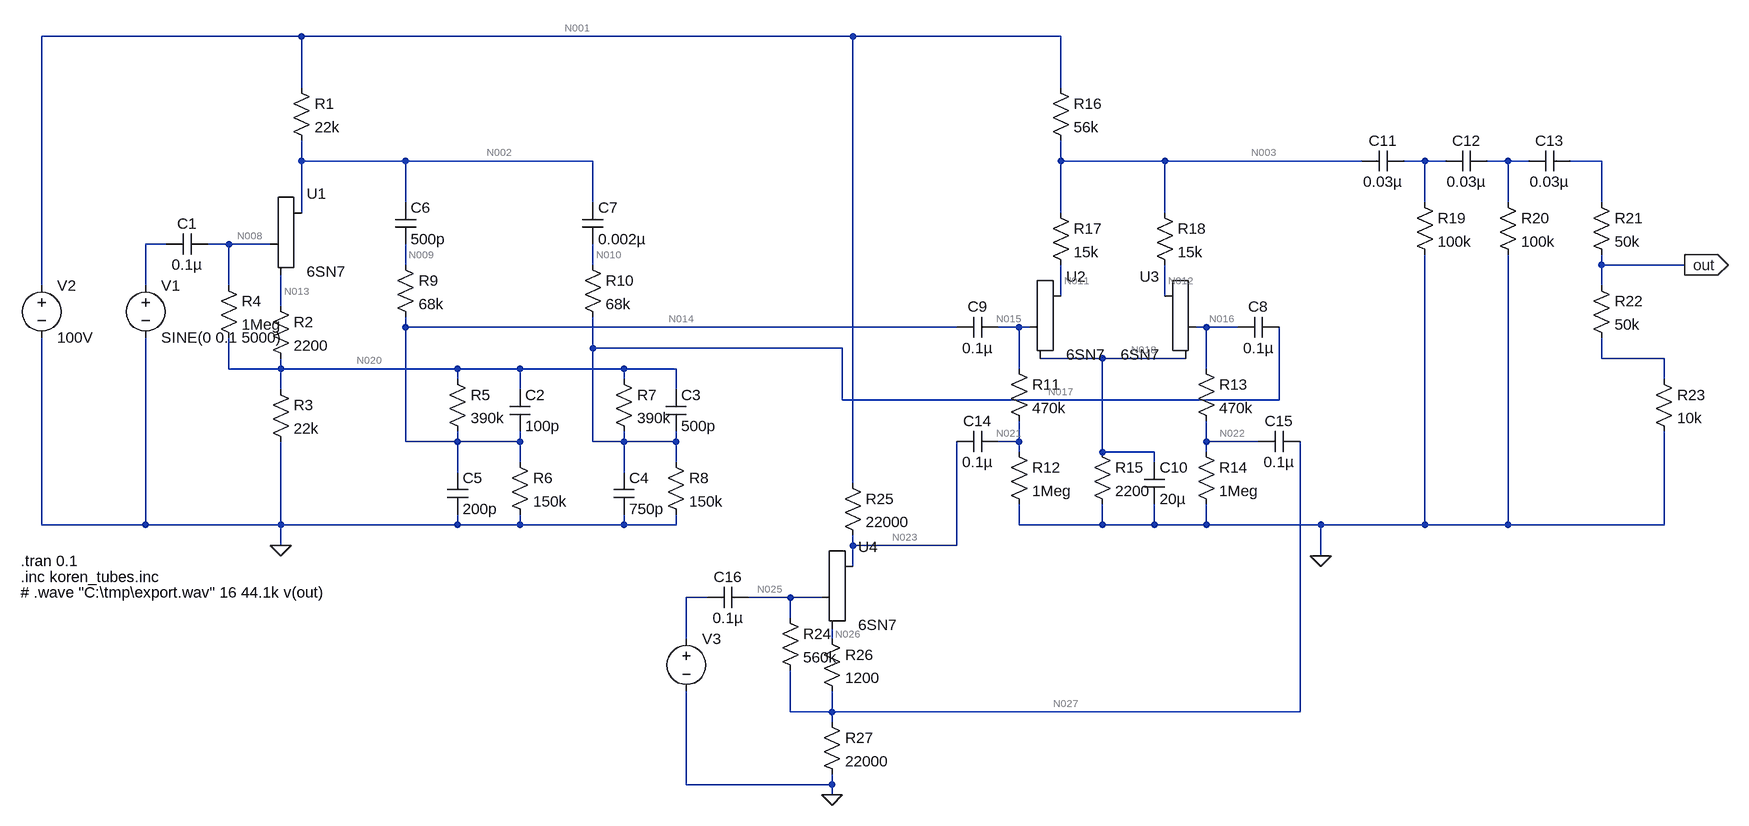
[diagram p0: schematic wurlitzer vibrato.asc]
wurlitzer vibrato.asc, the LTspice schematic file:
Version 4
SHEET 1 2576 1012
WIRE 192 -176 -208 -176
WIRE 1040 -176 192 -176
WIRE 1360 -176 1040 -176
WIRE 192 -96 192 -176
WIRE 1360 -96 1360 -176
WIRE 192 16 192 -16
WIRE 352 16 192 16
WIRE 640 16 352 16
WIRE 1360 16 1360 -16
WIRE 1520 16 1360 16
WIRE 1824 16 1520 16
WIRE 1920 16 1888 16
WIRE 1952 16 1920 16
WIRE 2048 16 2016 16
WIRE 2080 16 2048 16
WIRE 2192 16 2144 16
WIRE 352 80 352 16
WIRE 640 80 640 16
WIRE 1920 80 1920 16
WIRE 2048 80 2048 16
WIRE 2192 80 2192 16
WIRE 192 96 192 16
WIRE 1360 96 1360 16
WIRE 1520 96 1520 16
WIRE -16 144 -48 144
WIRE 80 144 48 144
WIRE 144 144 80 144
WIRE 352 176 352 144
WIRE 640 176 640 144
WIRE 2192 176 2192 160
WIRE 2320 176 2192 176
WIRE -208 208 -208 -176
WIRE -48 208 -48 144
WIRE 80 208 80 144
WIRE 2192 208 2192 176
WIRE 1360 224 1360 176
WIRE 1520 224 1520 176
WIRE 160 240 160 192
WIRE 352 272 352 256
WIRE 1200 272 352 272
WIRE 1296 272 1264 272
WIRE 1312 272 1296 272
WIRE 1584 272 1568 272
WIRE 1632 272 1584 272
WIRE 640 304 640 256
WIRE 1024 304 640 304
WIRE 1424 320 1328 320
WIRE 1552 320 1424 320
WIRE 2192 320 2192 288
WIRE 2288 320 2192 320
WIRE 80 336 80 288
WIRE 160 336 160 320
WIRE 160 336 80 336
WIRE 432 336 160 336
WIRE 528 336 432 336
WIRE 688 336 528 336
WIRE 768 336 688 336
WIRE 1296 336 1296 272
WIRE 1584 336 1584 272
WIRE 432 352 432 336
WIRE 688 352 688 336
WIRE 2288 352 2288 320
WIRE 160 368 160 336
WIRE 528 368 528 336
WIRE 768 368 768 336
WIRE 1024 384 1024 304
WIRE 1696 384 1696 272
WIRE 1696 384 1024 384
WIRE 352 448 352 272
WIRE 432 448 432 432
WIRE 432 448 352 448
WIRE 528 448 528 432
WIRE 528 448 432 448
WIRE 640 448 640 304
WIRE 688 448 688 432
WIRE 688 448 640 448
WIRE 768 448 768 432
WIRE 768 448 688 448
WIRE 1296 448 1296 416
WIRE 1296 448 1264 448
WIRE 1584 448 1584 416
WIRE 1664 448 1584 448
WIRE 1296 464 1296 448
WIRE 1424 464 1424 320
WIRE 1504 464 1424 464
WIRE 1584 464 1584 448
WIRE 528 480 528 448
WIRE 768 480 768 448
WIRE 1504 480 1504 464
WIRE 432 496 432 448
WIRE 688 496 688 448
WIRE 1040 512 1040 -176
WIRE -208 576 -208 288
WIRE -48 576 -48 288
WIRE -48 576 -208 576
WIRE 160 576 160 448
WIRE 160 576 -48 576
WIRE 432 576 432 560
WIRE 432 576 160 576
WIRE 528 576 528 560
WIRE 528 576 432 576
WIRE 688 576 688 560
WIRE 688 576 528 576
WIRE 768 576 768 560
WIRE 768 576 688 576
WIRE 1296 576 1296 544
WIRE 1424 576 1424 544
WIRE 1424 576 1296 576
WIRE 1504 576 1504 544
WIRE 1504 576 1424 576
WIRE 1584 576 1584 544
WIRE 1584 576 1504 576
WIRE 1760 576 1584 576
WIRE 1920 576 1920 160
WIRE 1920 576 1760 576
WIRE 2048 576 2048 160
WIRE 2048 576 1920 576
WIRE 2288 576 2288 432
WIRE 2288 576 2048 576
WIRE 160 608 160 576
WIRE 1040 608 1040 592
WIRE 1200 608 1200 448
WIRE 1200 608 1040 608
WIRE 1760 624 1760 576
WIRE 1040 640 1040 608
WIRE 816 688 784 688
WIRE 944 688 880 688
WIRE 992 688 944 688
WIRE 944 720 944 688
WIRE 784 752 784 688
WIRE 1008 752 1008 736
WIRE 944 864 944 800
WIRE 1008 864 1008 832
WIRE 1008 864 944 864
WIRE 1728 864 1728 448
WIRE 1728 864 1008 864
WIRE 1008 880 1008 864
WIRE 784 976 784 832
WIRE 1008 976 1008 960
WIRE 1008 976 784 976
WIRE 1008 992 1008 976
FLAG 160 608 0
FLAG 1760 624 0
FLAG 1008 992 0
FLAG 2320 176 out
IOPIN 2320 176 Out
SYMBOL Misc\\triode 192 144 R0
SYMATTR InstName U1
SYMATTR Value 6SN7
SYMATTR SpiceModel 6SN7
SYMBOL res 176 -112 R0
SYMATTR InstName R1
SYMATTR Value 22k
SYMBOL res 144 224 R0
SYMATTR InstName R2
SYMATTR Value 2200
SYMBOL res 144 352 R0
SYMATTR InstName R3
SYMATTR Value 22k
SYMBOL res 64 192 R0
SYMATTR InstName R4
SYMATTR Value 1Meg
SYMBOL cap 48 128 R90
WINDOW 0 0 32 VBottom 2
WINDOW 3 32 32 VTop 2
SYMATTR InstName C1
SYMATTR Value 0.1µ
SYMBOL voltage -48 192 R0
WINDOW 123 0 0 Left 2
WINDOW 39 0 0 Left 2
SYMATTR InstName V1
SYMATTR Value SINE(0 0.1 5000)
SYMBOL voltage -208 192 R0
WINDOW 123 0 0 Left 2
WINDOW 39 0 0 Left 2
SYMATTR InstName V2
SYMATTR Value 100V
SYMBOL res 416 336 R0
SYMATTR InstName R5
SYMATTR Value 390k
SYMBOL res 512 464 R0
SYMATTR InstName R6
SYMATTR Value 150k
SYMBOL res 672 336 R0
SYMATTR InstName R7
SYMATTR Value 390k
SYMBOL res 752 464 R0
SYMATTR InstName R8
SYMATTR Value 150k
SYMBOL cap 512 368 R0
SYMATTR InstName C2
SYMATTR Value 100p
SYMBOL cap 752 368 R0
SYMATTR InstName C3
SYMATTR Value 500p
SYMBOL cap 672 496 R0
SYMATTR InstName C4
SYMATTR Value 750p
SYMBOL cap 416 496 R0
SYMATTR InstName C5
SYMATTR Value 200p
SYMBOL cap 336 80 R0
SYMATTR InstName C6
SYMATTR Value 500p
SYMBOL cap 624 80 R0
SYMATTR InstName C7
SYMATTR Value 0.002µ
SYMBOL res 336 160 R0
SYMATTR InstName R9
SYMATTR Value 68k
SYMBOL res 624 160 R0
SYMATTR InstName R10
SYMATTR Value 68k
SYMBOL cap 1696 256 R90
WINDOW 0 0 32 VBottom 2
WINDOW 3 32 32 VTop 2
SYMATTR InstName C8
SYMATTR Value 0.1µ
SYMBOL cap 1264 256 R90
WINDOW 0 0 32 VBottom 2
WINDOW 3 32 32 VTop 2
SYMATTR InstName C9
SYMATTR Value 0.1µ
SYMBOL Misc\\triode 1360 272 R0
SYMATTR InstName U2
SYMATTR Value 6SN7
SYMATTR SpiceModel 6SN7
SYMBOL Misc\\triode 1520 272 M0
SYMATTR InstName U3
SYMATTR Value 6SN7
SYMATTR SpiceModel 6SN7
SYMBOL res 1280 320 R0
SYMATTR InstName R11
SYMATTR Value 470k
SYMBOL res 1280 448 R0
SYMATTR InstName R12
SYMATTR Value 1Meg
SYMBOL res 1568 320 R0
SYMATTR InstName R13
SYMATTR Value 470k
SYMBOL res 1568 448 R0
SYMATTR InstName R14
SYMATTR Value 1Meg
SYMBOL res 1408 448 R0
SYMATTR InstName R15
SYMATTR Value 2200
SYMBOL cap 1488 480 R0
SYMATTR InstName C10
SYMATTR Value 20µ
SYMBOL res 1344 -112 R0
SYMATTR InstName R16
SYMATTR Value 56k
SYMBOL res 1344 80 R0
SYMATTR InstName R17
SYMATTR Value 15k
SYMBOL res 1504 80 R0
SYMATTR InstName R18
SYMATTR Value 15k
SYMBOL cap 1888 0 R90
WINDOW 0 0 32 VBottom 2
WINDOW 3 32 32 VTop 2
SYMATTR InstName C11
SYMATTR Value 0.03µ
SYMBOL cap 2016 0 R90
WINDOW 0 0 32 VBottom 2
WINDOW 3 32 32 VTop 2
SYMATTR InstName C12
SYMATTR Value 0.03µ
SYMBOL cap 2144 0 R90
WINDOW 0 0 32 VBottom 2
WINDOW 3 32 32 VTop 2
SYMATTR InstName C13
SYMATTR Value 0.03µ
SYMBOL res 1904 64 R0
SYMATTR InstName R19
SYMATTR Value 100k
SYMBOL res 2032 64 R0
SYMATTR InstName R20
SYMATTR Value 100k
SYMBOL res 2176 64 R0
SYMATTR InstName R21
SYMATTR Value 50k
SYMBOL res 2176 192 R0
SYMATTR InstName R22
SYMATTR Value 50k
SYMBOL res 2272 336 R0
SYMATTR InstName R23
SYMATTR Value 10k
SYMBOL Misc\\triode 1040 688 R0
SYMATTR InstName U4
SYMATTR Value 6SN7
SYMATTR SpiceModel 6SN7
SYMBOL res 928 704 R0
SYMATTR InstName R24
SYMATTR Value 560k
SYMBOL res 1024 496 R0
SYMATTR InstName R25
SYMATTR Value 22000
SYMBOL res 992 736 R0
SYMATTR InstName R26
SYMATTR Value 1200
SYMBOL res 992 864 R0
SYMATTR InstName R27
SYMATTR Value 22000
SYMBOL cap 1264 432 R90
WINDOW 0 0 32 VBottom 2
WINDOW 3 32 32 VTop 2
SYMATTR InstName C14
SYMATTR Value 0.1µ
SYMBOL cap 1728 432 R90
WINDOW 0 0 32 VBottom 2
WINDOW 3 32 32 VTop 2
SYMATTR InstName C15
SYMATTR Value 0.1µ
SYMBOL cap 880 672 R90
WINDOW 0 0 32 VBottom 2
WINDOW 3 32 32 VTop 2
SYMATTR InstName C16
SYMATTR Value 0.1µ
SYMBOL voltage 784 736 R0
WINDOW 123 0 0 Left 2
WINDOW 39 0 0 Left 2
SYMATTR InstName V3
SYMATTR Value ""
TEXT -240 632 Left 2 !.tran 0.1
TEXT -240 656 Left 2 !.inc koren_tubes.inc
TEXT -240 680 Left 2 !# .wave "C:\\tmp\\export.wav" 16 44.1k v(out)

The netlist it stands for:
* wurlitzer vibrato.asc
XU1 N002 N008 N013 6SN7 6SN7
R1 N001 N002 22k
R2 N013 N020 2200
R3 N020 0 22k
R4 N008 N020 1Meg
C1 N008 N007 0.1µ
V1 N007 0 SINE(0 0.1 5000)
V2 N001 0 100V
R5 N020 N014 390k
R6 N014 0 150k
R7 N020 N017 390k
R8 N017 0 150k
C2 N020 N014 100p
C3 N020 N017 500p
C4 N017 0 750p
C5 N014 0 200p
C6 N002 N009 500p
C7 N002 N010 0.002µ
R9 N009 N014 68k
R10 N010 N017 68k
C8 N017 N016 0.1µ
C9 N015 N014 0.1µ
XU2 N011 N015 N018 6SN7 6SN7
XU3 N012 N016 N018 6SN7 6SN7
R11 N015 N021 470k
R12 N021 0 1Meg
R13 N016 N022 470k
R14 N022 0 1Meg
R15 N018 0 2200
C10 N018 0 20µ
R16 N001 N003 56k
R17 N003 N011 15k
R18 N003 N012 15k
C11 N004 N003 0.03µ
C12 N005 N004 0.03µ
C13 N006 N005 0.03µ
R19 N004 0 100k
R20 N005 0 100k
R21 N006 out 50k
R22 out N019 50k
R23 N019 0 10k
XU4 N023 N025 N026 6SN7 6SN7
R24 N025 N027 560k
R25 N001 N023 22000
R26 N026 N027 1200
R27 N027 0 22000
C14 N021 N023 0.1µ
C15 N027 N022 0.1µ
C16 N025 N024 0.1µ
V3 N024 0
.tran 0.1
.inc koren_tubes.inc
# .wave "C:\tmp\export.wav" 16 44.1k v(out)
.backanno
.end

* Results of the author's LTspice run, read from the files saved beside the schematic
* Operating Point, zero values left out:
*   V(n002) = 79.12 V
*   V(n013) = 21.4 V
*   V(n008) = 19.31 V
*   V(n001) = 100 V
*   V(n020) = 19.31 V
*   V(n014) = 5.364 V
*   V(n017) = 5.364 V
*   V(n009) = 5.364 V
*   V(n010) = 5.364 V
*   V(n016) = 1.473 mV
*   V(n015) = 1.473 mV
*   V(n011) = 46.41 V
*   V(n018) = 1.857 V
*   V(n012) = 46.41 V
*   V(n021) = 1.002 mV
*   V(n022) = 1.002 mV
*   V(n003) = 52.74 V
*   V(n023) = 74.15 V
*   V(n026) = 27.26 V
*   V(n025) = 25.85 V
*   V(n027) = 25.85 V
*   I(R27) = 1.175 mA
*   I(R26) = 1.175 mA
*   I(R25) = 1.175 mA
*   I(R24) = 1.001 nA
*   I(R18) = 421.9 µA
*   I(R17) = 421.9 µA
*   I(R16) = 843.9 µA
*   I(R15) = 843.9 µA
*   I(R14) = 1.002 nA
*   I(R13) = 1.002 nA
*   I(R12) = 1.002 nA
*   I(R11) = 1.002 nA
*   I(R8) = 35.76 µA
*   I(R7) = 35.76 µA
*   I(R6) = 35.76 µA
*   I(R5) = 35.76 µA
*   I(R4) = 1.002 nA
*   I(R3) = 877.8 µA
*   I(R2) = 949.3 µA
*   I(R1) = 949.3 µA
*   I(V2) = -2.968 mA
*   Ix(u1:1) = 949.3 µA
*   Ix(u1:2) = -1.002 nA
*   Ix(u1:3) = -949.3 µA
*   Ix(u2:1) = 421.9 µA
*   Ix(u2:2) = -1.002 nA
*   Ix(u2:3) = -421.9 µA
*   Ix(u3:1) = 421.9 µA
*   Ix(u3:2) = -1.002 nA
*   Ix(u3:3) = -421.9 µA
*   Ix(u4:1) = 1.175 mA
*   Ix(u4:2) = -1.001 nA
*   Ix(u4:3) = -1.175 mA